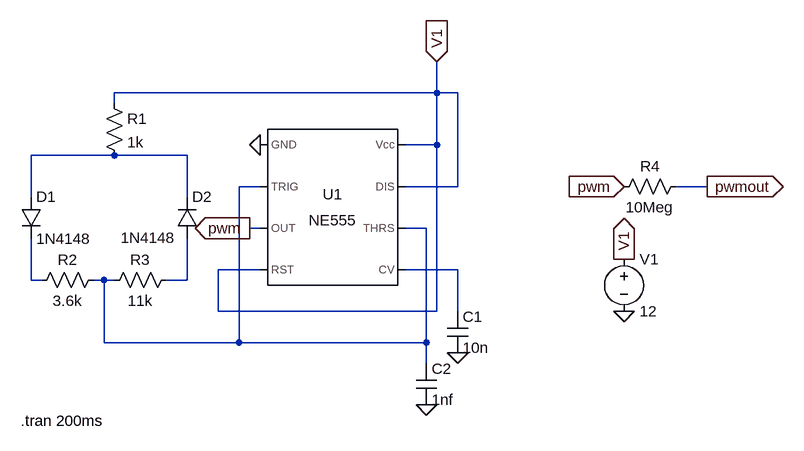
[diagram p0: schematic Draft1.asc]
Draft1.asc, the LTspice schematic file:
Version 4.1
SHEET 1 956 680
WIRE 384 16 384 -32
WIRE 384 16 -112 16
WIRE 416 16 384 16
WIRE -112 32 -112 16
WIRE 384 96 384 16
WIRE 384 96 336 96
WIRE -112 112 -240 112
WIRE 0 112 -112 112
WIRE 112 160 80 160
WIRE 416 160 416 16
WIRE 416 160 336 160
WIRE 800 160 752 160
WIRE -240 176 -240 112
WIRE 0 176 0 112
WIRE 112 224 96 224
WIRE 368 224 336 224
WIRE 112 288 48 288
WIRE 416 288 336 288
WIRE -240 304 -240 240
WIRE -224 304 -240 304
WIRE -128 304 -144 304
WIRE -112 304 -128 304
WIRE 0 304 0 240
WIRE 0 304 -32 304
WIRE 48 352 48 288
WIRE 384 352 384 96
WIRE 384 352 48 352
WIRE 416 352 416 288
WIRE -128 400 -128 304
WIRE 80 400 80 160
WIRE 80 400 -128 400
WIRE 368 400 368 224
WIRE 368 400 80 400
WIRE 368 432 368 400
FLAG 112 96 0
FLAG 416 416 0
FLAG 368 496 0
FLAG 384 -32 V1
IOPIN 384 -32 In
FLAG 96 224 pwm
IOPIN 96 224 Out
FLAG 672 160 pwm
IOPIN 672 160 In
FLAG 800 160 pwmout
IOPIN 800 160 Out
FLAG 672 352 0
FLAG 672 272 V1
IOPIN 672 272 Out
SYMBOL Misc\\NE555 224 192 R0
SYMATTR InstName U1
SYMBOL cap 400 352 R0
SYMATTR InstName C1
SYMATTR Value 10n
SYMBOL res -128 16 R0
SYMATTR InstName R1
SYMATTR Value 1k
SYMBOL diode -256 176 R0
SYMATTR InstName D1
SYMATTR Value 1N4148
SYMBOL diode -16 240 M180
WINDOW 0 24 64 Left 2
WINDOW 3 -86 1 Left 2
SYMATTR InstName D2
SYMATTR Value 1N4148
SYMBOL res -128 288 R90
WINDOW 0 0 56 VBottom 2
WINDOW 3 32 56 VTop 2
SYMATTR InstName R2
SYMATTR Value 3.6k
SYMBOL res -16 288 R90
WINDOW 0 0 56 VBottom 2
WINDOW 3 32 56 VTop 2
SYMATTR InstName R3
SYMATTR Value 11k
SYMBOL cap 352 432 R0
SYMATTR InstName C2
SYMATTR Value 1nf
SYMBOL res 768 144 R90
WINDOW 0 0 56 VBottom 2
WINDOW 3 32 56 VTop 2
SYMATTR InstName R4
SYMATTR Value 10Meg
SYMBOL voltage 672 256 R0
WINDOW 123 0 0 Left 0
WINDOW 39 0 0 Left 0
SYMATTR InstName V1
SYMATTR Value 12
TEXT -256 520 Left 2 !.tran 200ms

The netlist it stands for:
* Draft1.asc
X§U1 0 N002 pwm V1 N003 N002 V1 V1 NE555  ; pins GND TRIG OUT RST CV THRS DIS Vcc
C1 N003 0 10n
R1 V1 N001 1k
D1 N001 N004 1N4148
D2 N005 N001 1N4148
R2 N002 N004 3.6k
R3 N005 N002 11k
C2 N002 0 1nf
R4 pwmout pwm 10Meg
V1 V1 0 12
.model D D
.lib standard.dio
.tran 200ms
.lib NE555.sub
.backanno
.end